# Altium schematic sheet 2017_FDP_PROPULSION.SchDoc
size A2
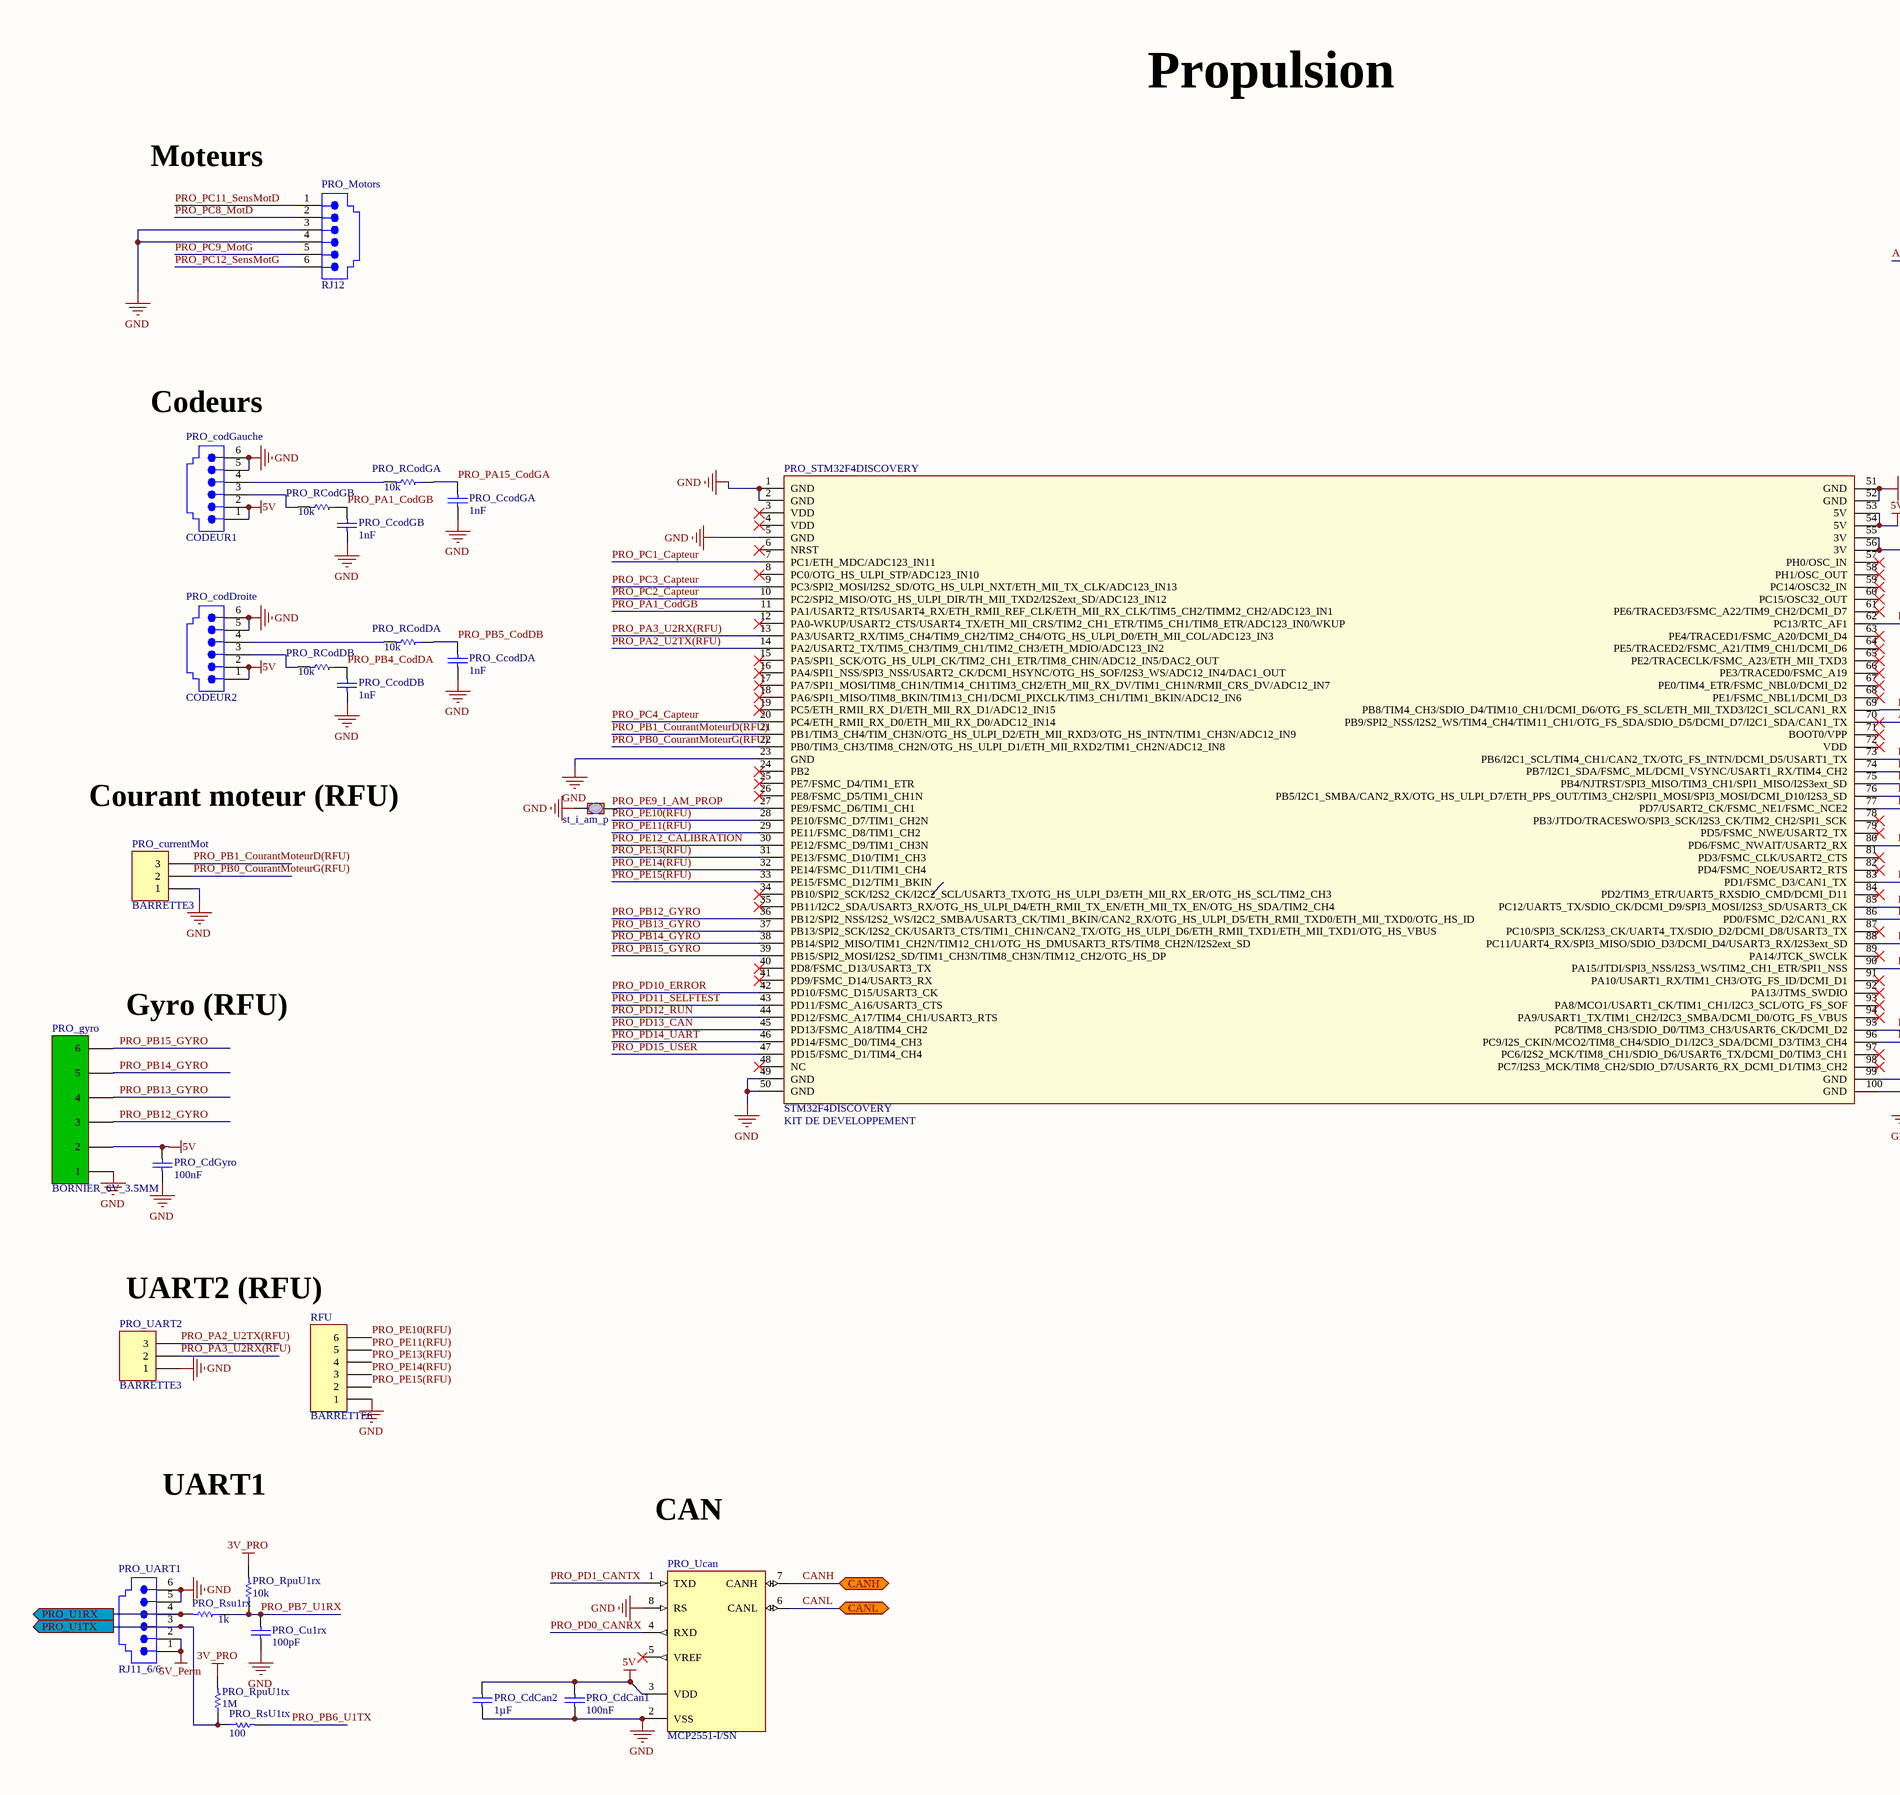
[diagram p0: 2017_FDP_PROPULSION.SchDoc, left]
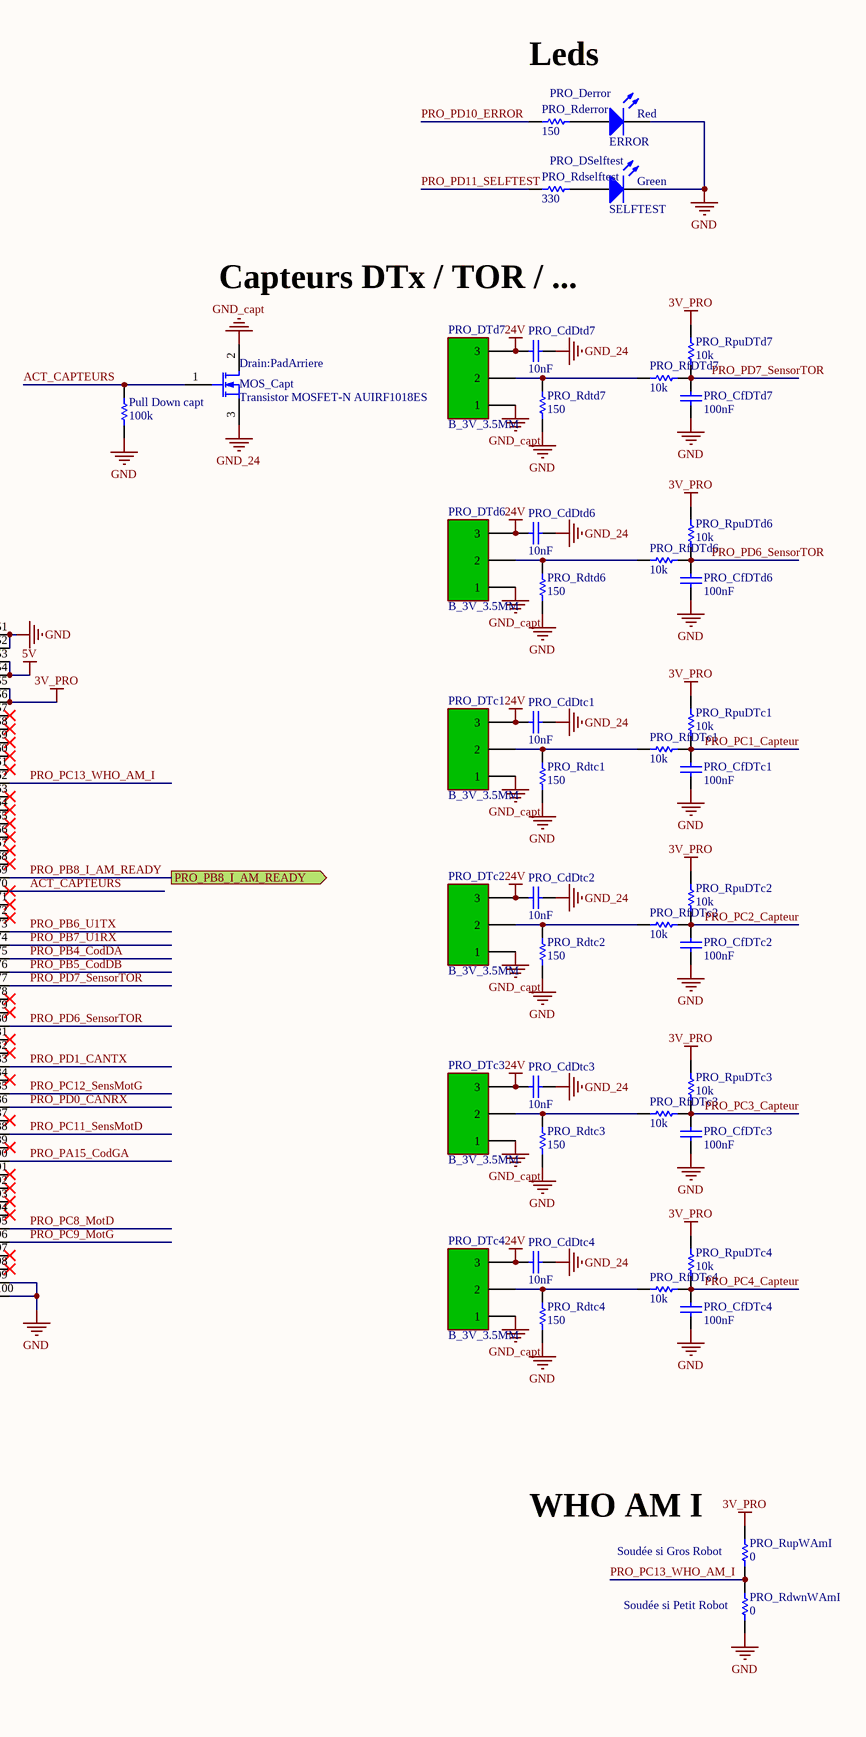
[diagram p1: 2017_FDP_PROPULSION.SchDoc, right]

## Parts
MOS_Capt  Transistor MOSFET-N AUIRF1018ES  [D2PAK_GROS_PAD]
PRO_CcodDA  1nF  [C0805_N]
PRO_CcodDB  1nF  [C0805_N]
PRO_CcodGA  1nF  [C0805_N]
PRO_CcodGB  1nF  [C0805_N]
PRO_CdCan1  100nF  [C0805_N]
PRO_CdCan2  1µF  [C0805_N]
PRO_CdDtc1  10nF  [C0805_N]
PRO_CdDtc2  10nF  [C0805_N]
PRO_CdDtc3  10nF  [C0805_N]
PRO_CdDtc4  10nF  [C0805_N]
PRO_CdDtd6  10nF  [C0805_N]
PRO_CdDtd7  10nF  [C0805_N]
PRO_CdGyro  100nF  [C0805_N]
PRO_CfDTc1  100nF  [C0805_N]
PRO_CfDTc2  100nF  [C0805_N]
PRO_CfDTc3  100nF  [C0805_N]
PRO_CfDTc4  100nF  [C0805_N]
PRO_CfDTd6  100nF  [C0805_N]
PRO_CfDTd7  100nF  [C0805_N]
PRO_codDroite  CODEUR2  [RJ11_6/6 - droit]
PRO_codGauche  CODEUR1  [RJ11_6/6 - droit]
PRO_Cu1rx  100pF  [C0805_N]
PRO_currentMot  BARRETTE3  [HE14_3]
PRO_Derror  ERROR  [LED_0805]
PRO_DSelftest  SELFTEST  [LED_0805]
PRO_DTc1  B_3V_3.5MM  [BORNIER_3V_3.5MM]
PRO_DTc2  B_3V_3.5MM  [BORNIER_3V_3.5MM]
PRO_DTc3  B_3V_3.5MM  [BORNIER_3V_3.5MM]
PRO_DTc4  B_3V_3.5MM  [BORNIER_3V_3.5MM]
PRO_DTd6  B_3V_3.5MM  [BORNIER_3V_3.5MM]
PRO_DTd7  B_3V_3.5MM  [BORNIER_3V_3.5MM]
PRO_gyro  BORNIER_6V_3.5MM  [BORNIER_6V_3.5MM]
PRO_Motors  RJ12  [RJ11_6/6 - droit]
PRO_RCodDA  10k  [R1206_N]
PRO_RCodDB  10k  [R1206_N]
PRO_RCodGA  10k  [R1206_N]
PRO_RCodGB  10k  [R1206_N]
PRO_Rderror  150  [R1206_N]
PRO_Rdselftest  330  [R1206_N]
PRO_Rdtc1  150  [R1206_N]
PRO_Rdtc2  150  [R1206_N]
PRO_Rdtc3  150  [R1206_N]
PRO_Rdtc4  150  [R1206_N]
PRO_Rdtd6  150  [R1206_N]
PRO_Rdtd7  150  [R1206_N]
PRO_RdwnWAmI  0  [R1206_N]
PRO_RfDTc1  10k  [R1206_N]
PRO_RfDTc2  10k  [R1206_N]
PRO_RfDTc3  10k  [R1206_N]
PRO_RfDTc4  10k  [R1206_N]
PRO_RfDTd6  10k  [R1206_N]
PRO_RfDTd7  10k  [R1206_N]
PRO_RpuDTc1  10k  [R1206_N]
PRO_RpuDTc2  10k  [R1206_N]
PRO_RpuDTc3  10k  [R1206_N]
PRO_RpuDTc4  10k  [R1206_N]
PRO_RpuDTd6  10k  [R1206_N]
PRO_RpuDTd7  10k  [R1206_N]
PRO_RpuU1rx  10k  [R1206_N]
PRO_RpuU1tx  1M  [R1206_N]
PRO_Rsu1rx  1k  [R1206_N]
PRO_RsU1tx  100  [R1206_N]
PRO_RupWAmI  0  [R1206_N]
PRO_STM32F4DISCOVERY  STM32F4DISCOVERY  Type: KIT DE DEVELOPPEMENT  [STM32_F4DISCOVERY]
PRO_UART1  RJ11_6/6  [RJ11_6/6 - droit]
PRO_UART2  BARRETTE3  [HE14_3]
PRO_Ucan  MCP2551-I/SN  [SO8_N]
Pull_Down_capt  100k  [R1206_N]
RFU  BARRETTE6  [HE14_6]
st_i_am_p  Goutte Strap_2  [Goutte Strap_2 Pads_Clearance 0.254mm]  (value not drawn)

## Ports
CANH (bidir), CANL (bidir), PRO_PB8_I_AM_READY (out), PRO_U1RX (out), PRO_U1TX (out)

## Nets
3V_PRO: PRO_RpuDTc1.2 PRO_RpuDTc2.2 PRO_RpuDTc3.2 PRO_RpuDTc4.2 PRO_RpuDTd6.2 PRO_RpuDTd7.2 PRO_RpuU1rx.2 PRO_RpuU1tx.2 PRO_RupWAmI.2 PRO_STM32F4DISCOVERY.55(3V) PRO_STM32F4DISCOVERY.56(3V)
5V: PRO_CdCan1.2 PRO_CdCan2.2 PRO_CdGyro.2 PRO_codDroite.1 PRO_codDroite.2 PRO_codGauche.1 PRO_codGauche.2 PRO_gyro.2 PRO_STM32F4DISCOVERY.53(5V) PRO_STM32F4DISCOVERY.54(5V) PRO_Ucan.3(VDD)
5V_Perm: PRO_UART1.1 PRO_UART1.2
24V: PRO_CdDtc1.2 PRO_CdDtc2.2 PRO_CdDtc3.2 PRO_CdDtc4.2 PRO_CdDtd6.2 PRO_CdDtd7.2 PRO_DTc1.3 PRO_DTc2.3 PRO_DTc3.3 PRO_DTc4.3 PRO_DTd6.3 PRO_DTd7.3
GND: PRO_CcodDA.1 PRO_CcodDB.1 PRO_CcodGA.1 PRO_CcodGB.1 PRO_CdCan1.1 PRO_CdCan2.1 PRO_CdGyro.1 PRO_CfDTc1.1 PRO_CfDTc2.1 PRO_CfDTc3.1 PRO_CfDTc4.1 PRO_CfDTd6.1 PRO_CfDTd7.1 PRO_codDroite.5 PRO_codDroite.6 PRO_codGauche.5 PRO_codGauche.6 PRO_Cu1rx.1 PRO_currentMot.1 PRO_Derror.2(K) PRO_DSelftest.2(K) PRO_gyro.1 PRO_Motors.3 PRO_Motors.4 PRO_Rdtc1.1 PRO_Rdtc2.1 PRO_Rdtc3.1 PRO_Rdtc4.1 PRO_Rdtd6.1 PRO_Rdtd7.1 PRO_RdwnWAmI.1 PRO_STM32F4DISCOVERY.1(GND) PRO_STM32F4DISCOVERY.2(GND) PRO_STM32F4DISCOVERY.5(GND) PRO_STM32F4DISCOVERY.23(GND) PRO_STM32F4DISCOVERY.49(GND) PRO_STM32F4DISCOVERY.50(GND) PRO_STM32F4DISCOVERY.51(GND) PRO_STM32F4DISCOVERY.52(GND) PRO_STM32F4DISCOVERY.99(GND) PRO_STM32F4DISCOVERY.100(GND) PRO_UART1.5 PRO_UART1.6 PRO_UART2.1 PRO_Ucan.2(VSS) PRO_Ucan.8(RS) Pull_Down_capt.1 RFU.1 st_i_am_p.1
GND_24: MOS_Capt.3(S) PRO_CdDtc1.1 PRO_CdDtc2.1 PRO_CdDtc3.1 PRO_CdDtc4.1 PRO_CdDtd6.1 PRO_CdDtd7.1
GND_capt: MOS_Capt.2(D) PRO_DTc1.1 PRO_DTc2.1 PRO_DTc3.1 PRO_DTc4.1 PRO_DTd6.1 PRO_DTd7.1
ACT_CAPTEURS: MOS_Capt.1(G) PRO_STM32F4DISCOVERY.70(PB9/SPI2_NSS/I2S2_WS/TIM4_CH4/TIM11_CH1/OTG_FS_SDA/SDIO_D5/DCMI_D7/I2C1_SDA/CAN1_TX) Pull_Down_capt.2
CANH: PRO_Ucan.7(CANH) ; port CANH
CANL: PRO_Ucan.6(CANL) ; port CANL
PRO_PA1_CodGB: PRO_CcodGB.2 PRO_RCodGB.1 PRO_STM32F4DISCOVERY.11(PA1/USART2_RTS/USART4_RX/ETH_RMII_REF_CLK/ETH_MII_RX_CLK/TIM5_CH2/TIMM2_CH2/ADC123_IN1)
PRO_PA2_U2TX(RFU): PRO_STM32F4DISCOVERY.14(PA2/USART2_TX/TIM5_CH3/TIM9_CH1/TIM2_CH3/ETH_MDIO/ADC123_IN2) PRO_UART2.3
PRO_PA3_U2RX(RFU): PRO_STM32F4DISCOVERY.13(PA3/USART2_RX/TIM5_CH4/TIM9_CH2/TIM2_CH4/OTG_HS_ULPI_D0/ETH_MII_COL/ADC123_IN3) PRO_UART2.2
PRO_PA15_CodGA: PRO_CcodGA.2 PRO_RCodGA.1 PRO_STM32F4DISCOVERY.90(PA15/JTDI/SPI3_NSS/I2S3_WS/TIM2_CH1_ETR/SPI1_NSS)
PRO_PB0_CourantMoteurG(RFU): PRO_currentMot.2 PRO_STM32F4DISCOVERY.22(PB0/TIM3_CH3/TIM8_CH2N/OTG_HS_ULPI_D1/ETH_MII_RXD2/TIM1_CH2N/ADC12_IN8)
PRO_PB1_CourantMoteurD(RFU): PRO_currentMot.3 PRO_STM32F4DISCOVERY.21(PB1/TIM3_CH4/TIM_CH3N/OTG_HS_ULPI_D2/ETH_MII_RXD3/OTG_HS_INTN/TIM1_CH3N/ADC12_IN9)
PRO_PB4_CodDA: PRO_CcodDB.2 PRO_RCodDB.1 PRO_STM32F4DISCOVERY.75(PB4/NJTRST/SPI3_MISO/TIM3_CH1/SPI1_MISO/I2S3ext_SD)
PRO_PB5_CodDB: PRO_CcodDA.2 PRO_RCodDA.1 PRO_STM32F4DISCOVERY.76(PB5/I2C1_SMBA/CAN2_RX/OTG_HS_ULPI_D7/ETH_PPS_OUT/TIM3_CH2/SPI1_MOSI/SPI3_MOSI/DCMI_D10/I2S3_SD)
PRO_PB6_U1TX: PRO_RsU1tx.2 PRO_STM32F4DISCOVERY.73(PB6/I2C1_SCL/TIM4_CH1/CAN2_TX/OTG_FS_INTN/DCMI_D5/USART1_TX)
PRO_PB7_U1RX: PRO_Cu1rx.2 PRO_RpuU1rx.1 PRO_Rsu1rx.1 PRO_STM32F4DISCOVERY.74(PB7/I2C1_SDA/FSMC_ML/DCMI_VSYNC/USART1_RX/TIM4_CH2)
PRO_PB8_I_AM_READY: PRO_STM32F4DISCOVERY.69(PB8/TIM4_CH3/SDIO_D4/TIM10_CH1/DCMI_D6/OTG_FS_SCL/ETH_MII_TXD3/I2C1_SCL/CAN1_RX) ; port PRO_PB8_I_AM_READY
PRO_PB12_GYRO: PRO_gyro.3 PRO_STM32F4DISCOVERY.36(PB12/SPI2_NSS/I2S2_WS/I2C2_SMBA/USART3_CK/TIM1_BKIN/CAN2_RX/OTG_HS_ULPI_D5/ETH_RMII_TXD0/ETH_MII_TXD0/OTG_HS_ID)
PRO_PB13_GYRO: PRO_gyro.4 PRO_STM32F4DISCOVERY.37(PB13/SPI2_SCK/I2S2_CK/USART3_CTS/TIM1_CH1N/CAN2_TX/OTG_HS_ULPI_D6/ETH_RMII_TXD1/ETH_MII_TXD1/OTG_HS_VBUS)
PRO_PB14_GYRO: PRO_gyro.5 PRO_STM32F4DISCOVERY.38(PB14/SPI2_MISO/TIM1_CH2N/TIM12_CH1/OTG_HS_DMUSART3_RTS/TIM8_CH2N/I2S2ext_SD)
PRO_PB15_GYRO: PRO_gyro.6 PRO_STM32F4DISCOVERY.39(PB15/SPI2_MOSI/I2S2_SD/TIM1_CH3N/TIM8_CH3N/TIM12_CH2/OTG_HS_DP)
PRO_PC1_Capteur: PRO_CfDTc1.2 PRO_RfDTc1.2 PRO_RpuDTc1.1 PRO_STM32F4DISCOVERY.7(PC1/ETH_MDC/ADC123_IN11)
PRO_PC2_Capteur: PRO_CfDTc2.2 PRO_RfDTc2.2 PRO_RpuDTc2.1 PRO_STM32F4DISCOVERY.10(PC2/SPI2_MISO/OTG_HS_ULPI_DIR/TH_MII_TXD2/I2S2ext_SD/ADC123_IN12)
PRO_PC3_Capteur: PRO_CfDTc3.2 PRO_RfDTc3.2 PRO_RpuDTc3.1 PRO_STM32F4DISCOVERY.9(PC3/SPI2_MOSI/I2S2_SD/OTG_HS_ULPI_NXT/ETH_MII_TX_CLK/ADC123_IN13)
PRO_PC4_Capteur: PRO_CfDTc4.2 PRO_RfDTc4.2 PRO_RpuDTc4.1 PRO_STM32F4DISCOVERY.20(PC4/ETH_RMII_RX_D0/ETH_MII_RX_D0/ADC12_IN14)
PRO_PC8_MotD: PRO_Motors.2 PRO_STM32F4DISCOVERY.95(PC8/TIM8_CH3/SDIO_D0/TIM3_CH3/USART6_CK/DCMI_D2)
PRO_PC9_MotG: PRO_Motors.5 PRO_STM32F4DISCOVERY.96(PC9/I2S_CKIN/MCO2/TIM8_CH4/SDIO_D1/I2C3_SDA/DCMI_D3/TIM3_CH4)
PRO_PC11_SensMotD: PRO_Motors.1 PRO_STM32F4DISCOVERY.88(PC11/UART4_RX/SPI3_MISO/SDIO_D3/DCMI_D4/USART3_RX/I2S3ext_SD)
PRO_PC12_SensMotG: PRO_Motors.6 PRO_STM32F4DISCOVERY.85(PC12/UART5_TX/SDIO_CK/DCMI_D9/SPI3_MOSI/I2S3_SD/USART3_CK)
PRO_PC13_WHO_AM_I: PRO_RdwnWAmI.2 PRO_RupWAmI.1 PRO_STM32F4DISCOVERY.62(PC13/RTC_AF1)
PRO_PD0_CANRX: PRO_STM32F4DISCOVERY.86(PD0/FSMC_D2/CAN1_RX) PRO_Ucan.4(RXD)
PRO_PD1_CANTX: PRO_STM32F4DISCOVERY.83(PD1/FSMC_D3/CAN1_TX) PRO_Ucan.1(TXD)
PRO_PD6_SensorTOR: PRO_CfDTd6.2 PRO_RfDTd6.2 PRO_RpuDTd6.1 PRO_STM32F4DISCOVERY.80(PD6/FSMC_NWAIT/USART2_RX)
PRO_PD7_SensorTOR: PRO_CfDTd7.2 PRO_RfDTd7.2 PRO_RpuDTd7.1 PRO_STM32F4DISCOVERY.77(PD7/USART2_CK/FSMC_NE1/FSMC_NCE2)
PRO_PD10_ERROR: PRO_Rderror.1 PRO_STM32F4DISCOVERY.42(PD10/FSMC_D15/USART3_CK)
PRO_PD11_SELFTEST: PRO_Rdselftest.1 PRO_STM32F4DISCOVERY.43(PD11/FSMC_A16/USART3_CTS)
PRO_PD12_RUN: PRO_STM32F4DISCOVERY.44(PD12/FSMC_A17/TIM4_CH1/USART3_RTS)
PRO_PD13_CAN: PRO_STM32F4DISCOVERY.45(PD13/FSMC_A18/TIM4_CH2)
PRO_PD14_UART: PRO_STM32F4DISCOVERY.46(PD14/FSMC_D0/TIM4_CH3)
PRO_PD15_USER: PRO_STM32F4DISCOVERY.47(PD15/FSMC_D1/TIM4_CH4)
PRO_PE10(RFU): PRO_STM32F4DISCOVERY.28(PE10/FSMC_D7/TIM1_CH2N) RFU.6
PRO_PE11(RFU): PRO_STM32F4DISCOVERY.29(PE11/FSMC_D8/TIM1_CH2) RFU.5
PRO_PE12_CALIBRATION: PRO_STM32F4DISCOVERY.30(PE12/FSMC_D9/TIM1_CH3N)
PRO_PE13(RFU): PRO_STM32F4DISCOVERY.31(PE13/FSMC_D10/TIM1_CH3) RFU.4
PRO_PE14(RFU): PRO_STM32F4DISCOVERY.32(PE14/FSMC_D11/TIM1_CH4) RFU.3
PRO_PE15(RFU): PRO_STM32F4DISCOVERY.33(PE15/FSMC_D12/TIM1_BKIN) RFU.2
PRO_U1RX: PRO_Rsu1rx.2 PRO_UART1.4 ; port PRO_U1RX
PRO_U1TX: PRO_RpuU1tx.1 PRO_RsU1tx.1 PRO_UART1.3 ; port PRO_U1TX
NetPRO_codDroite_3: PRO_codDroite.3 PRO_RCodDB.2
NetPRO_codDroite_4: PRO_codDroite.4 PRO_RCodDA.2
NetPRO_codGauche_3: PRO_codGauche.3 PRO_RCodGB.2
NetPRO_codGauche_4: PRO_codGauche.4 PRO_RCodGA.2
NetPRO_Derror_1: PRO_Derror.1(A) PRO_Rderror.2
NetPRO_DSelftest_1: PRO_DSelftest.1(A) PRO_Rdselftest.2
NetPRO_DTc1_2: PRO_DTc1.2 PRO_Rdtc1.2 PRO_RfDTc1.1
NetPRO_DTc2_2: PRO_DTc2.2 PRO_Rdtc2.2 PRO_RfDTc2.1
NetPRO_DTc3_2: PRO_DTc3.2 PRO_Rdtc3.2 PRO_RfDTc3.1
NetPRO_DTc4_2: PRO_DTc4.2 PRO_Rdtc4.2 PRO_RfDTc4.1
NetPRO_DTd6_2: PRO_DTd6.2 PRO_Rdtd6.2 PRO_RfDTd6.1
NetPRO_DTd7_2: PRO_DTd7.2 PRO_Rdtd7.2 PRO_RfDTd7.1
NetPRO_STM32F4DISCOVERY_27: PRO_STM32F4DISCOVERY.27(PE9/FSMC_D6/TIM1_CH1) st_i_am_p.2

Not connected (* = marked no-connect by the designer): PRO_STM32F4DISCOVERY 3(VDD)* 4(VDD)* 6(NRST)* 8(PC0/OTG_HS_ULPI_STP/ADC123_IN10)* 12(PA0-WKUP/USART2_CTS/USART4_TX/ETH_MII_CRS/TIM2_CH1_ETR/TIM5_CH1/TIM8_ETR/ADC123_IN0/WKUP)* 15(PA5/SPI1_SCK/OTG_HS_ULPI_CK/TIM2_CH1_ETR/TIM8_CHIN/ADC12_IN5/DAC2_OUT)* 16(PA4/SPI1_NSS/SPI3_NSS/USART2_CK/DCMI_HSYNC/OTG_HS_SOF/I2S3_WS/ADC12_IN4/DAC1_OUT)* 17(PA7/SPI1_MOSI/TIM8_CH1N/TIM14_CH1TIM3_CH2/ETH_MII_RX_DV/TIM1_CH1N/RMII_CRS_DV/ADC12_IN7)* 18(PA6/SPI1_MISO/TIM8_BKIN/TIM13_CH1/DCMI_PIXCLK/TIM3_CH1/TIM1_BKIN/ADC12_IN6)* 19(PC5/ETH_RMII_RX_D1/ETH_MII_RX_D1/ADC12_IN15)* 24(PB2)* 25(PE7/FSMC_D4/TIM1_ETR)* 26(PE8/FSMC_D5/TIM1_CH1N)* 34(PB10/SPI2_SCK/I2S2_CK/I2C2_SCL/USART3_TX/OTG_HS_ULPI_D3/ETH_MII_RX_ER/OTG_HS_SCL/TIM2_CH3)* 35(PB11/I2C2_SDA/USART3_RX/OTG_HS_ULPI_D4/ETH_RMII_TX_EN/ETH_MII_TX_EN/OTG_HS_SDA/TIM2_CH4)* 40(PD8/FSMC_D13/USART3_TX)* 41(PD9/FSMC_D14/USART3_RX)* 48(NC)* 57(PH0/OSC_IN)* 58(PH1/OSC_OUT)* 59(PC14/OSC32_IN)* 60(PC15/OSC32_OUT)* 61(PE6/TRACED3/FSMC_A22/TIM9_CH2/DCMI_D7)* 63(PE4/TRACED1/FSMC_A20/DCMI_D4)* 64(PE5/TRACED2/FSMC_A21/TIM9_CH1/DCMI_D6)* 65(PE2/TRACECLK/FSMC_A23/ETH_MII_TXD3)* 66(PE3/TRACED0/FSMC_A19)* 67(PE0/TIM4_ETR/FSMC_NBL0/DCMI_D2)* 68(PE1/FSMC_NBL1/DCMI_D3)* 71(BOOT0/VPP)* 72(VDD)* 78(PB3/JTDO/TRACESWO/SPI3_SCK/I2S3_CK/TIM2_CH2/SPI1_SCK)* 79(PD5/FSMC_NWE/USART2_TX)* 81(PD3/FSMC_CLK/USART2_CTS)* 82(PD4/FSMC_NOE/USART2_RTS)* 84(PD2/TIM3_ETR/UART5_RXSDIO_CMD/DCMI_D11)* 87(PC10/SPI3_SCK/I2S3_CK/UART4_TX/SDIO_D2/DCMI_D8/USART3_TX)* 89(PA14/JTCK_SWCLK)* 91(PA10/USART1_RX/TIM1_CH3/OTG_FS_ID/DCMI_D1)* 92(PA13/JTMS_SWDIO)* 93(PA8/MCO1/USART1_CK/TIM1_CH1/I2C3_SCL/OTG_FS_SOF)* 94(PA9/USART1_TX/TIM1_CH2/I2C3_SMBA/DCMI_D0/OTG_FS_VBUS)* 97(PC6/I2S2_MCK/TIM8_CH1/SDIO_D6/USART6_TX/DCMI_D0/TIM3_CH1)* 98(PC7/I2S3_MCK/TIM8_CH2/SDIO_D7/USART6_RX_DCMI_D1/TIM3_CH2)*; PRO_Ucan 5(VREF)*

## Notes on the sheet
- Leds
- (near PRO_Derror) Red
- Propulsion
- (near PRO_DSelftest) Green
- Moteurs
- Capteurs DTx / TOR / ...
- (near PRO_codGauche) Codeurs
- Courant moteur (RFU)
- (near PRO_gyro) Gyro (RFU)
- (near PRO_UART2) UART2 (RFU)
- WHO AM I
- (near PRO_RupWAmI) Soudée si Gros Robot
- (near PRO_RdwnWAmI) Soudée si Petit Robot
- UART1
- CAN
- Labels drawn without touching a wire or pin: PRO_PE9_I_AM_PROP
- Title
- Size:
- Date:
- File:
- A2
- Number:
- Time:
- Revision:
- Sheet
- of
- (in symbol Transistor MOSFET-N AUIRF1018ES) Drain:PadArriere

## Library data of the parts
MOS_Capt = Transistor MOSFET-N AUIRF1018ES: N-Channel MOSFET; PackageDocument: 1995/1996; Published: 8-Jun-2000; LatestRevisionDate: 17-Jul-2002; LatestRevisionNote: Re-released for DXP Platform.; PackageReference: E3; Publisher: Altium Limited
PRO_CcodDA PRO_CcodDB PRO_CcodGA PRO_CcodGB PRO_CdCan1 PRO_CdCan2 PRO_CdDtc1-PRO_CdDtc4 PRO_CdDtd6 PRO_CdDtd7 PRO_CdGyro PRO_CfDTc1-PRO_CfDTc4 PRO_CfDTd6 PRO_CfDTd7 PRO_Cu1rx = Condensateur: Capacitor; Published: 8-Jun-2000; LatestRevisionDate: 17-Jul-2002; LatestRevisionNote: Re-released for DXP Platform.; PackageReference: RAD-0.3; Publisher: Altium Limited
PRO_codDroite PRO_codGauche PRO_Motors PRO_UART1 = RJ11_6/6: Right Angle, Standard Profile, Offset Latch DECconnect, Flangeless PCB Jack; Ports: 1; Positions/Loaded: Port1 - 6 Offset Latch/6; PerformanceCategory: 3; PCB_Mounting: Thru-Hole; DrillSize: Nominal, Rounded to nearest 0.05mm; PCB_Layout: Complies with Manufacturer's Recommendation.; Published: 25-Jun-2002; DatasheetDocument: 18-Dec-2001; PackageDocument: 18-Dec-2001; PackageReference: 15-43-6110; Publisher: Altium Limited; ComponentLink1Description: Manufacturer Link; ComponentLink1URL: http://www.molex.com/; ComponentLink2Description: Datasheet; ComponentLink2URL: http://www.molex.com/cmc_upload/common_files/1212003_41369catalogpage.pdf
  PRO_Motors PRO_UART1: Type: RJ11_6/6
PRO_currentMot PRO_UART2 = BARRETTE3: Header, 3-Pin; LatestRevisionDate: 17-Jul-2002; LatestRevisionNote: Re-released for DXP Platform.; Publisher: Altium Limited
PRO_Derror PRO_DSelftest = LED: Typical LED; Published: 8-Jun-2000; LatestRevisionDate: 08-Jul-2005; LatestRevisionNote: Mech Layer 1 removed.; PackageReference: LED-1; Publisher: Altium Limited
PRO_DTc1-PRO_DTc4 PRO_DTd6 PRO_DTd7 = BORNIER_3V_3.5MM
PRO_RCodDA PRO_RCodDB PRO_RCodGA PRO_RCodGB PRO_Rderror PRO_Rdselftest PRO_Rdtc1-PRO_Rdtc4 PRO_Rdtd6 PRO_Rdtd7 PRO_RdwnWAmI PRO_RfDTc1-PRO_RfDTc4 PRO_RfDTd6 PRO_RfDTd7 PRO_RpuDTc1-PRO_RpuDTc4 PRO_RpuDTd6 PRO_RpuDTd7 PRO_RpuU1rx PRO_RpuU1tx PRO_Rsu1rx PRO_RsU1tx PRO_RupWAmI Pull_Down_capt = Resistor: Published: 8-Jun-2000; LatestRevisionDate: 17-Jul-2002; LatestRevisionNote: Re-released for DXP Platform.; PackageReference: AXIAL-0.5; Publisher: Altium Limited
PRO_STM32F4DISCOVERY = STM32F4DISCOVERY: KIT DE DEVELOPPEMENT POUR MICROCONTROLEUR STM32F407VGT6
PRO_Ucan = MCP2551-I/SN: High-Speed CAN Transceiver, 8-Pin SOIC, Industrial Temperature; Published: 25/11/09; DatasheetVersion: revE, Jan-2007; PackageVersion: revAW, Oct-2008; PackageReference: SOIC-SN8; Publisher: Damien Guitton; PackageDescription: 8-Lead Plastic Small Outline (SN) - Narrow, 3.90mm Body [SOIC]; Code_JEDEC: MS-012; Code_IPC: SOIC127P600-8; ComponentLink1Description: Manufacturer Link; ComponentLink1URL: http://www.microchip.com; ComponentLink2Description: Datasheet; ComponentLink2URL: http://ww1.microchip.com/downloads/en/DeviceDoc/21667E.pdf; ComponentLink3Description: Packaging Specification; ComponentLink3URL: http://ww1.microchip.com/downloads/en/PackagingSpec/00049AW.pdf
RFU = BARRETTE6: Header, 6-Pin; LatestRevisionDate: 17-Jul-2002; LatestRevisionNote: Re-released for DXP Platform.; Publisher: Altium Limited
st_i_am_p = Goutte Strap_2: LatestRevisionDate: 30/01/11; Publisher: Damien Guitton